# EAGLE design eggShield (EAGLE 6.1)
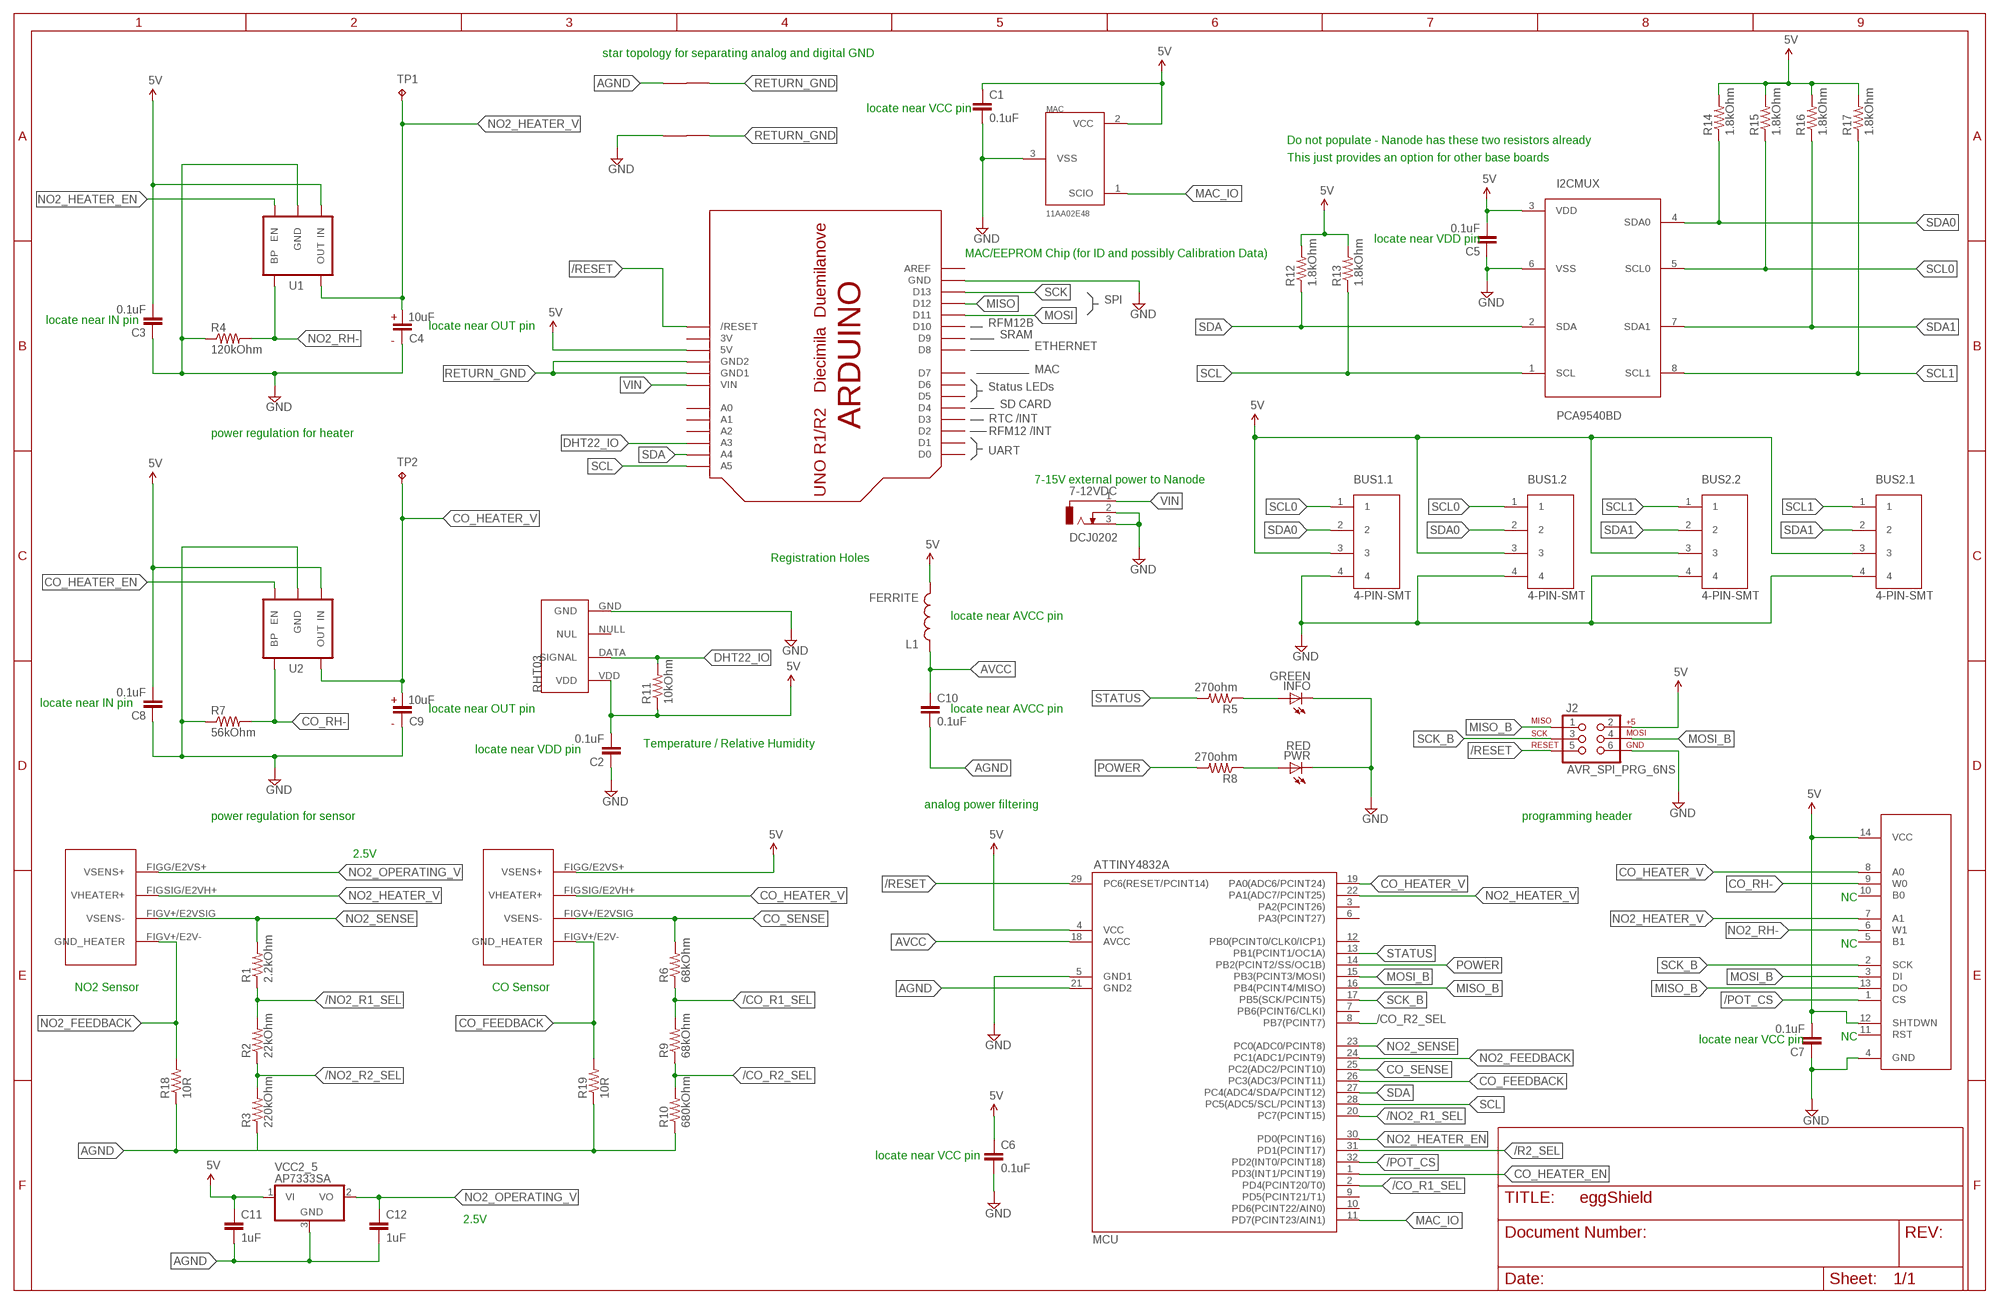
[diagram p0: schematic, sheet 1]

## Parts
7-12VDC  DCJ0202  [DCJ0202]
BUS1.1  4-PIN-SMT  [1775470-4]
BUS1.2  4-PIN-SMT  [1775470-4]
BUS2.1  4-PIN-SMT  [1775470-4]
BUS2.2  4-PIN-SMT  [1775470-4]
C1  0.1uF  CAP0805  [0805]
C2  0.1uF  CAP0805  [0805]
C3  0.1uF  CAP0805  [0805]
C4  10uF  EEE-1EA100WR  [TYPE-B_ALUMINUM_CAN]
C5  0.1uF  CAP0805  [0805]
C6  0.1uF  CAP0805  [0805]
C7  0.1uF  CAP0805  [0805]
C8  0.1uF  CAP0805  [0805]
C9  10uF  EEE-1EA100WR  [TYPE-B_ALUMINUM_CAN]
C10  0.1uF  CAP0805  [0805]
C11  1uF  CAP0805  [0805]
C12  1uF  CAP0805  [0805]
CO  E2V  [SR-4]
DHT22  RHT03  [1X04_LOCK]
I2CMUX  PCA9540BD  [SO8]
INFO  GREEN  LEDCHIPLED_0805  [CHIPLED_0805]
J2  AVR_SPI_PRG_6NS  [2X3-NS]
L1  FERRITE  INDUCTOR0805  [0805]
MAC  11AA02E48  [SOT23]
MCU  ATTINY4832A  [TQFP32-08]
N02  E2V  [SR-4]
PWR  RED  LEDCHIPLED_0805  [CHIPLED_0805]
R1  2.2kOhm  RESISTOR0805-RES  [0805]
R2  22kOhm  RESISTOR0805-RES  [0805]
R3  220kOhm  RESISTOR0805-RES  [0805]
R4  120kOhm  RESISTOR0805-RES  [0805]
R5  270ohm  RESISTOR0805-RES  [0805]
R6  68kOhm  RESISTOR0805-RES  [0805]
R7  56kOhm  RESISTOR0805-RES  [0805]
R8  270ohm  RESISTOR0805-RES  [0805]
R9  68kOhm  RESISTOR0805-RES  [0805]
R10  680kOhm  RESISTOR0805-RES  [0805]
R11  10kOhm  RESISTOR0805-RES  [0805]
R12  1.8kOhm  RESISTOR0805-RES  [0805]
R13  1.8kOhm  RESISTOR0805-RES  [0805]
R14  1.8kOhm  RESISTOR0805-RES  [0805]
R15  1.8kOhm  RESISTOR0805-RES  [0805]
R16  1.8kOhm  RESISTOR0805-RES  [0805]
R17  1.8kOhm  RESISTOR0805-RES  [0805]
R18  10R  RESISTOR0805-RES  [0805]
R19  10R  RESISTOR0805-RES  [0805]
TP1  TPPAD1-13  [P1-13]
TP2  TPPAD1-13  [P1-13]
U1  V_REG_LDOSMD  [SOT23-5]
U2  V_REG_LDOSMD  [SOT23-5]
U3  MCP42XXX  [SO014]
U$7  ARDUINO-NOHOLE  [ARDUINO-NOHOLE]
U$13  PLANE_COUPLER  [PLANE_COUPLER]
U$14  PLANE_COUPLER  [PLANE_COUPLER]
VCC2_5  AP7333SA  [SOT-23-3]

## Nets
5V: BUS1.1.3 BUS1.2.3 BUS2.1.3 BUS2.2.3 C1.1 C2.2 C3.2 C5.2 C6.1 C7.2 C8.2 C11.1 CO.FIGG/E2VS+(VSENS+) DHT22.VDD I2CMUX.3(VDD) J2.2 L1.2 MAC.2(VCC) MCU.4(VCC) R11.1 R12.2 R13.2 R14.2 R15.2 R16.2 R17.2 U1.1(IN) U2.1(IN) U3.12(SHTDWN) U3.14(VCC) U$7.5V VCC2_5.1(VI)
/CO_R1_SEL: MCU.2(PD4(PCINT20/T0)) R6.1 R9.2
/CO_R2_SEL: MCU.8(PB7(PCINT7)) R9.1 R10.2
/NO2_R1_SEL: MCU.20(PC7(PCINT15)) R1.1 R2.2
/NO2_R2_SEL: R2.1 R3.2
/POT_CS: MCU.32(PD2(INT0/PCINT18)) U3.1(CS)
/R2_SEL: MCU.31(PD1(PCINT17))
/RESET: J2.5 MCU.29(PC6(RESET/PCINT14)) U$7.RESET(/RESET)
AGND: C10.2 C11.2 C12.2 MCU.21(GND2) R3.1 R10.1 R18.1 R19.1 U$13.1 VCC2_5.3(GND)
AVCC: C10.1 L1.1 MCU.18(AVCC)
CO_FEEDBACK: CO.FIGV+/E2V-(GND_HEATER) MCU.26(PC3(ADC3/PCINT11)) R19.2
CO_HEATER_EN: MCU.1(PD3(INT1/PCINT19)) U2.3(EN)
CO_HEATER_V: C9.P$1 CO.FIGSIG/E2VH+(VHEATER+) MCU.19(PA0(ADC6/PCINT24)) TP2.TP U2.5(OUT) U3.8(A0)
CO_RH-: R7.2 U2.4(BP) U3.9(W0)
CO_SENSE: CO.FIGV+/E2VSIG(VSENS-) MCU.25(PC2(ADC2/PCINT10)) R6.2
DHT22_IO: DHT22.DATA(SIGNAL) R11.2 U$7.A3
GND: 7-12VDC.2 7-12VDC.3 BUS1.1.4 BUS1.2.4 BUS2.1.4 BUS2.2.4 C1.2 C2.1 C3.1 C4.P$2 C5.1 C6.2 C7.1 C8.1 C9.P$2 DHT22.GND I2CMUX.6(VSS) INFO.C J2.6 MAC.3(VSS) MCU.5(GND1) PWR.C R4.1 R7.1 U1.2(GND) U2.2(GND) U3.4(GND) U$7.GND U$14.1
MAC_IO: MAC.1(SCIO) MCU.11(PD7(PCINT23/AIN1))
MISO: U$7.D12
MISO_B: J2.1 MCU.16(PB4(PCINT4/MISO)) U3.13(DO)
MOSI: U$7.D11
MOSI_B: J2.4 MCU.15(PB3(PCINT3/MOSI)) U3.3(DI)
N$1: INFO.A R5.1
N$3: PWR.A R8.1
NO2_FEEDBACK: MCU.24(PC1(ADC1/PCINT9)) N02.FIGV+/E2V-(GND_HEATER) R18.2
NO2_HEATER_EN: MCU.30(PD0(PCINT16)) U1.3(EN)
NO2_HEATER_V: C4.P$1 MCU.22(PA1(ADC7/PCINT25)) N02.FIGSIG/E2VH+(VHEATER+) TP1.TP U1.5(OUT) U3.7(A1)
NO2_OPERATING_V: C12.1 N02.FIGG/E2VS+(VSENS+) VCC2_5.2(VO)
NO2_RH-: R4.2 U1.4(BP) U3.6(W1)
NO2_SENSE: MCU.23(PC0(ADC0/PCINT8)) N02.FIGV+/E2VSIG(VSENS-) R1.2
POWER: MCU.14(PB2(PCINT2/SS/OC1B)) R8.2
RETURN_GND: U$7.GND1 U$7.GND2 U$13.2 U$14.2
SCK: U$7.D13
SCK_B: J2.3 MCU.17(PB5(SCK/PCINT5)) U3.2(SCK)
SCL: I2CMUX.1(SCL) MCU.28(PC5(ADC5/SCL/PCINT13)) R13.1 U$7.A5
SCL0: BUS1.1.1 BUS1.2.1 I2CMUX.5(SCL0) R15.1
SCL1: BUS2.1.1 BUS2.2.1 I2CMUX.8(SCL1) R17.1
SDA: I2CMUX.2(SDA) MCU.27(PC4(ADC4/SDA/PCINT12)) R12.1 U$7.A4
SDA0: BUS1.1.2 BUS1.2.2 I2CMUX.4(SDA0) R14.1
SDA1: BUS2.1.2 BUS2.2.2 I2CMUX.7(SDA1) R16.1
STATUS: MCU.13(PB1(PCINT1/OC1A)) R5.2
VIN: 7-12VDC.1 U$7.VIN
Unconnected: DHT22.NULL(NUL) MCU.3(PA2(PCINT26)) MCU.6(PA3(PCINT27)) MCU.7(PB6(PCINT6/CLKI)) MCU.9(PD5(PCINT21/T1)) MCU.10(PD6(PCINT22/AIN0)) MCU.12(PB0(PCINT0/CLK0/ICP1)) U3.5(B1) U3.10(B0) U3.11(RST) U$7.A0 U$7.A1 U$7.A2 U$7.AREF U$7.D0 U$7.D1 U$7.D2 U$7.D3 U$7.D4 U$7.D5 U$7.D6 U$7.D7 U$7.D8 U$7.D9 U$7.D10

## Notes on the sheet
- star topology for separating analog and digital GND
- locate near VCC pin
- Do not populate - Nanode has these two resistors already
- This just provides an option for other base boards
- locate near VDD pin
- MAC/EEPROM Chip (for ID and possibly Calibration Data)
- SPI
- locate near IN pin | 10uF
- locate near OUT pin | RFM12B
- SRAM
- ETHERNET
- MAC
- Status LEDs
- SD CARD
- RTC /INT
- power regulation for heater | RFM12 /INT
- UART
- 7-15V external power to Nanode
- Registration Holes
- locate near AVCC pin
- locate near IN pin | 10uF
- locate near OUT pin | locate near AVCC pin
- Temperature / Relative Humidity
- locate near VDD pin
- analog power filtering
- power regulation for sensor | programming header
- 2.5V
- NC
- NC
- NO2 Sensor | CO Sensor
- locate near VCC pin | NC
- locate near VCC pin
- 2.5V

## Power pins joined to a net without a drawn wire
3V: U$7.3V

## Library data of the parts
7-12VDC = con-jack:DCJ0202: DC POWER JACK Source: DCJ0202.pdf
BUS1.1 BUS1.2 BUS2.1 BUS2.2 = wicked-device:4-PIN-SMT
C1-C3 C5-C8 C10-C12 = SparkFun-Passives:CAP: Capacitor Standard 0603 ceramic capacitor, and 0.1" leaded capacitor.
C4 C9 = wicked-device:EEE-1EA100WR
CO N02 = ricardo:E2V
DHT22 = ricardo:RHT03
I2CMUX = wicked-device:PCA9540B
INFO PWR = adafruit:LED: LED OSRAM: - CHIPLED LG R971, LG N971, LY N971, LG Q971, LY Q971, LO R971, LY R971 LH N974, LH R974 LS Q976, LO Q976, LY Q976 LO Q996 - Hyper CHIPLED LW Q18S LB Q993, LB Q99A, LB R99A - SideLED LS A670, LO A670, LY A670, LG A670, LP A670 LB A673, LV A673, LT A673, LW A673 LH A674 LY A675 LS A676, LA A676, LO A676, LY A676, LW A676 LS A679, LY A679, LG A679 - Hyper Micro SIDELED® LS Y876, LA Y876, LO Y876, LY Y876 LT Y87S - SmartLED LW L88C, LW L88S LB L89C, LB L89S, LG L890 LS L89K, LO L89K, LY L89K LS L896, LA L896, LO L896, LY L896 - TOPLED LS T670, LO T670, LY T670, LG T670, LP T670 LSG T670, LSP T670, LSY T670, LOP T670, LYG T670 LG T671, LOG T671, LSG T671 LB T673, LV T673, LT T673, LW T673 LH T674 LS T676, LA T676, LO T676, LY T676, LB T676, LH T676, LSB T676, LW T676 LB T67C, LV T67C, LT T67C, LS T67K, LO T67K, LY T67K, LW E67C LS E67B, LA E67B, LO E67B, LY E67B, LB E67C, LV E67C, LT E67C LW T67C LS T679, LY T679, LG T679 LS T770, LO T770, LY T770, LG T770, LP T770 LB T773, LV T773, LT T773, LW T773 LH T774 LS E675, LA E675, LY E675, LS T675 LS T776, LA T776, LO T776, LY T776, LB T776 LHGB T686 LT T68C, LB T68C - Hyper Mini TOPLED® LB M676 - Mini TOPLED Santana® LG M470 LS M47K, LO M47K, LY M47K Source: http://www.osram.convergy.de/
J2 = SparkFun:AVR_SPI_PRG_6: AVR ISP 6 Pin This is the reduced ISP connector for AVR programming. Common on Arduino. This footprint will take up less PCB space and can be used with a 10-pin to 6-pin adapter such as SKU: BOB-08508
L1 = SparkFun-Passives:INDUCTOR: Inductors Basic Inductor/Choke - 0603 and 1206. Footprints are not proven and vary greatly between part numbers.
MAC = nanode:11AA02E48
MCU = axeio-SparkFun:ATTINY48: ATtiny48/88 in 32 pin configuration.
R1-R19 = SparkFun:RESISTOR: Resistor Basic schematic elements and footprints for 0603, 1206, and PTH resistors.
TP1 TP2 = testpad:TP: Test pad
U1 U2 = SparkFun:V_REG_LDO: Voltage Regulator LDO Standard 150mA LDO voltage regulator in SOT-23 layout. Micrel part MIC5205. BP (by-pass) pin is used to lower output noise with 470pF cap.
U3 = SparkFun-AnalogIC:MCP42XXX: SPI controlled dual digital potentiometer by Microchip
U$7 = adafruit:ARDUINO: Arduino Diecimila/Duemilanove Make a shield with ease, this package has all the named pins as well as the two mounting drill holes and an outline of the USB and DC power connector. The outline is on the DIMENSION layer, so if your board house uses it they will cut the outline to match. http://www.ladyada.net/library/pcb/eaglelibrary.html
U$13 U$14 = wicked-device:PLANE_COUPLER
VCC2_5 = wicked-device:AP7333

## Board
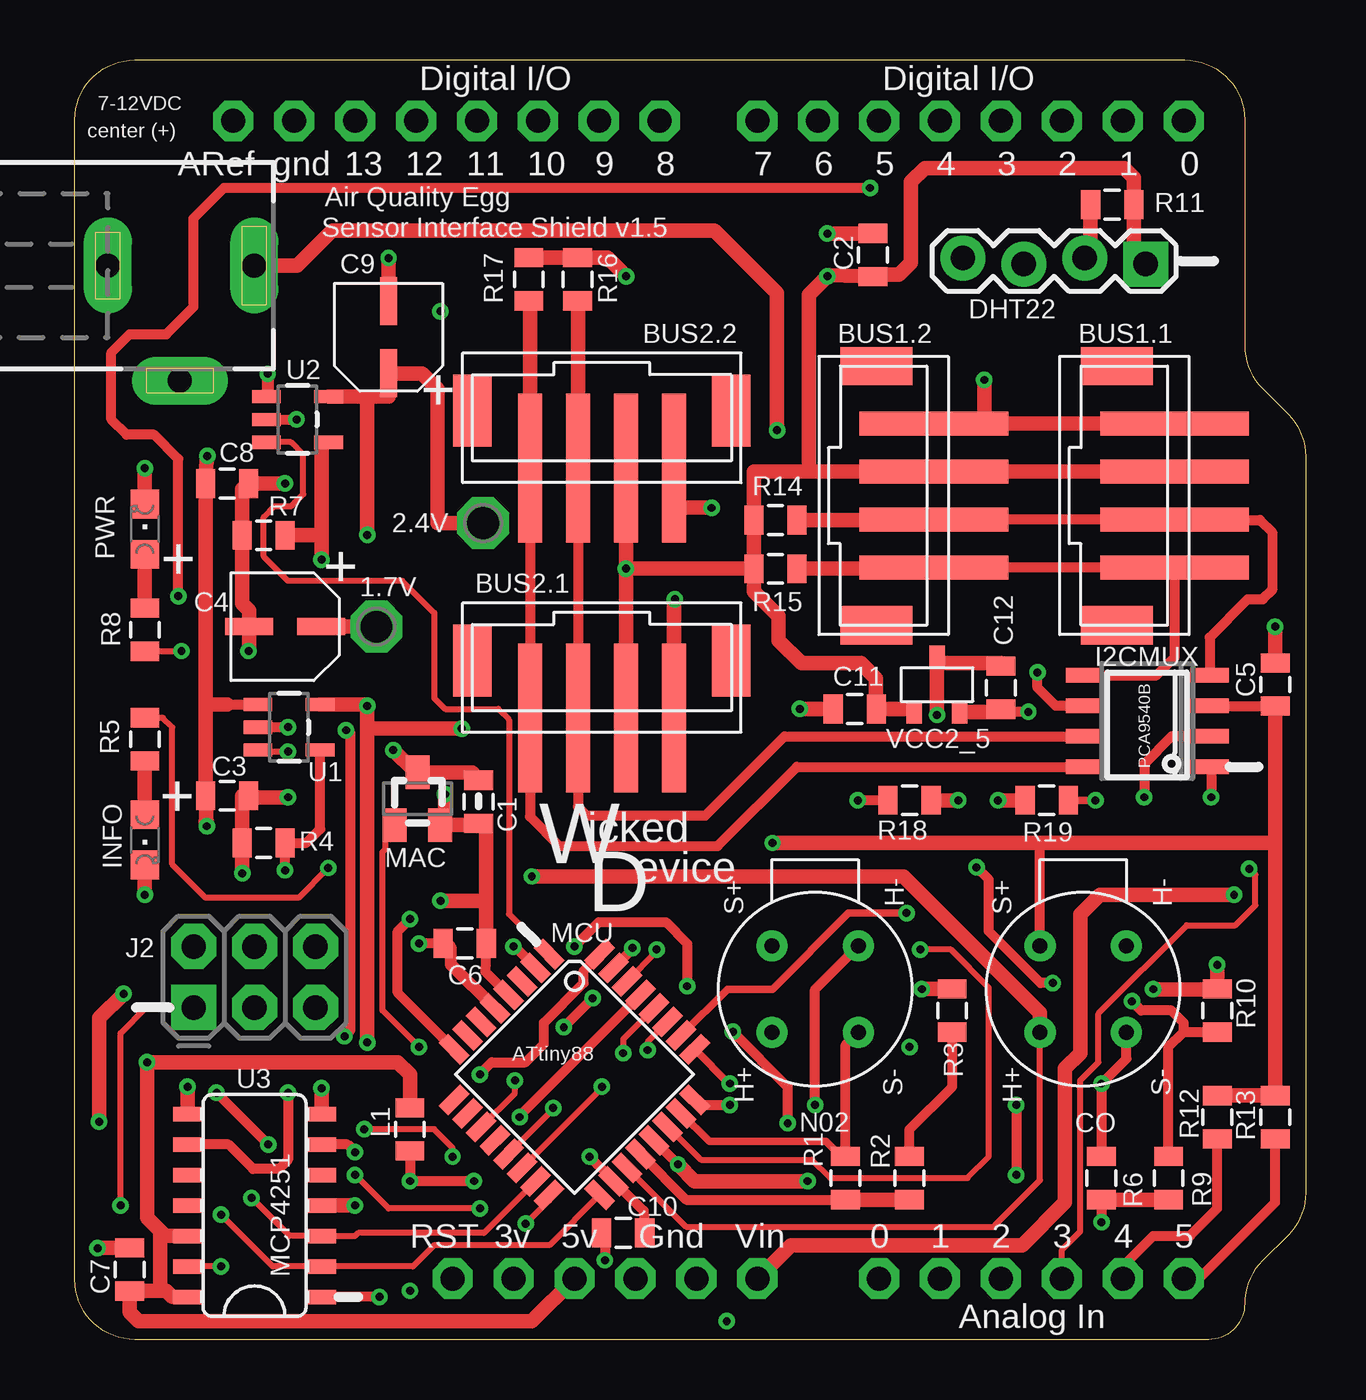
[diagram p1: board, top side]
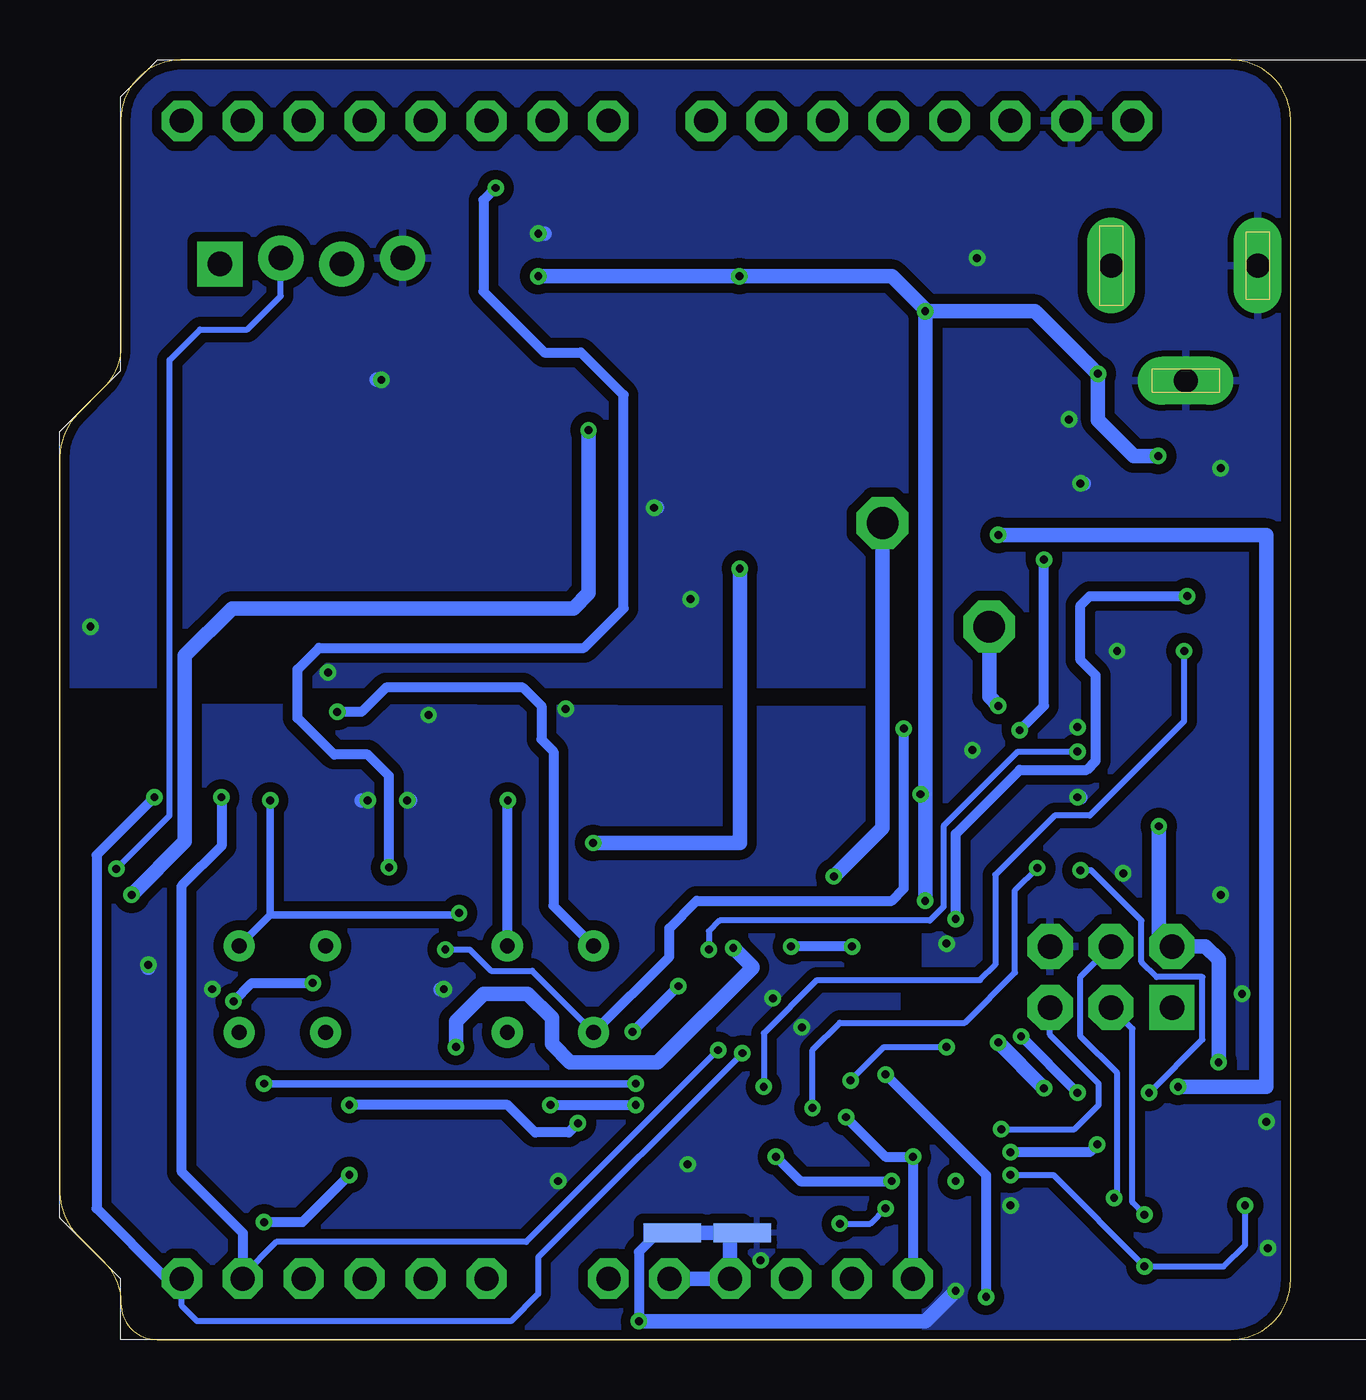
[diagram p2: board, bottom side, seen from below]

Size 51.31 x 53.34 mm. Coordinates in mm from the lower left corner, seen from the top.
Outline: 48.77,1.5 arc-90 47.26,0 2.5,0 arc-90 0,2.5 0,50.84 arc-90 2.5,53.34 46.27,53.34 arc-90 48.77,50.84 48.77,41.42 arc45 49.5,39.65 50.58,38.58 arc-45 51.31,36.81 51.31,6.12 arc-45 50.58,4.35 49.5,3.27 arc45 48.77,1.5
Copper layers (1*16): Top 0.0356mm / dielectric 1.5011mm / Bottom 0.0356mm
Design rules: minimum track width 6mil, minimum drill 13mil, track to track 6mil, track to pad 6mil, pad to pad 6mil, via to via 6mil, smd to smd 6mil, copper to edge 15mil, drill to drill 6mil, minimum pad ring 7mil, minimum via ring 7mil, stop-mask expansion 4mil, vias tented up to drill 20mil, thermal gap 10mil

### Footprints (pad centres in the part's own frame; a part is rotated, then mirrored left to right if it is on the bottom)
DCJ0202 = drill 1 pad 2 long: 1 0,3.1; 2 4.8,0; 3 0,-3
1775470-4 = smd 1 x 6.2: 1 3,0; 2 1,0; 3 -1,0; 4 -3,0 | smd 1.6 x 3: P$5 -5.4,-2.4; P$6 5.4,-2.4
0805 = smd 0.8 x 1.2: 1 -0.9,0; 2 0.9,0
TYPE-B_ALUMINUM_CAN = smd 0.7 x 2: P$1 0,-1.5; P$2 0,1.5
SR-4 = drill 0.62 pad 1.3: FIGG/E2VS+ 1.8,1.8; FIGSIG/E2VH+ -1.8,1.8; FIGV+/E2V- 1.8,-1.8; FIGV+/E2VSIG -1.8,-1.8
1X04_LOCK = drill 1.016 pad 1.88: DATA 2.54,-0.127; GND 7.62,-0.127; NULL 5.08,0.127 | drill 1.016 pad 1.88 square: VDD 0,0.127
SO8 = smd 0.6 x 1.6: 1 -1.905,-2.6; 2 -0.635,-2.6; 3 0.635,-2.6; 4 1.905,-2.6; 5 1.905,2.6; 6 0.635,2.6; 7 -0.635,2.6; 8 -1.905,2.6
CHIPLED_0805 = smd 1.2 x 1.2: A 0,-1.05; C 0,1.05
2X3-NS = drill 1.016 pad 1.88 square: 1 -2.54,-1.27 | drill 1.016 pad 1.88 octagon: 2 -2.54,1.27; 3 0,-1.27; 4 0,1.27; 5 2.54,-1.27; 6 2.54,1.27
SOT23 = smd 1 x 1.4: 1 -0.95,-1.1; 2 0.95,-1.1; 3 0,1.1
TQFP32-08 = smd 1.27 x 0.559: 1 -4.293,2.8; 2 -4.293,2; 3 -4.293,1.2; 4 -4.293,0.4; 5 -4.293,-0.4; 6 -4.293,-1.2; 7 -4.293,-2; 8 -4.293,-2.8; 17 4.293,-2.8; 18 4.293,-2; 19 4.293,-1.2; 20 4.293,-0.4; 21 4.293,0.4; 22 4.293,1.2; 23 4.293,2; 24 4.293,2.8 | smd 0.559 x 1.27: 9 -2.8,-4.293; 10 -2,-4.293; 11 -1.2,-4.293; 12 -0.4,-4.293; 13 0.4,-4.293; 14 1.2,-4.293; 15 2,-4.293; 16 2.8,-4.293; 25 2.8,4.293; 26 2,4.293; 27 1.2,4.293; 28 0.4,4.293; 29 -0.4,4.293; 30 -1.2,4.293; 31 -2,4.293; 32 -2.8,4.293
P1-13 = drill 1.321 pad 2.159 octagon: TP 0,0
SOT23-5 = smd 0.55 x 1.2: 1 -0.95,-1.3; 2 0,-1.3; 3 0.95,-1.3; 4 0.95,1.3; 5 -0.95,1.3
SO014 = smd 0.6 x 1.2: 1 -3.175,-2.8; 2 -1.905,-2.8; 3 -0.635,-2.8; 4 0.635,-2.8; 5 1.905,-2.8; 6 3.175,-2.8; 7 4.445,-2.8; 8 4.445,2.8; 9 3.175,2.8; 10 1.905,2.8; 11 0.635,2.8; 12 -0.635,2.8; 13 -1.905,2.8; 14 -3.175,2.8
ARDUINO-NOHOLE = drill 1 pad 1.676 octagon: 3V 35.56,2.54; 5V 38.1,2.54; A0 50.8,2.54; A1 53.34,2.54; A2 55.88,2.54; A3 58.42,2.54; A4 60.96,2.54; A5 63.5,2.54; AREF 23.876,50.8; D0 63.5,50.8; D1 60.96,50.8; D2 58.42,50.8; D3 55.88,50.8; D4 53.34,50.8; D5 50.8,50.8; D6 48.26,50.8; D7 45.72,50.8; D8 41.656,50.8; D9 39.116,50.8; D10 36.576,50.8; D11 34.036,50.8; D12 31.496,50.8; D13 28.956,50.8; GND 26.416,50.8; GND1 43.18,2.54; GND2 40.64,2.54; RESET 33.02,2.54; VIN 45.72,2.54
PLANE_COUPLER = smd 1.2 x 0.8: 1 -0.6,0; 2 0.6,0
SOT-23-3 = smd 0.65 x 0.95: 1 -0.95,-1.15; 2 0.95,-1.15; 3 0,1.15

### Placement (x,y rotation side)
7-12VDC  4.38,44.77 270 top
BUS1.1  45.85,35.18 270 top
BUS1.2  35.81,35.18 270 top
BUS2.1  21.97,25.91 180 top
BUS2.2  21.97,36.32 180 top
C1  16.83,22.42 90 top
C2  33.27,45.21 270 top
C3  6.35,22.67 180 top
C4  8.76,29.72 90 top
C5  50.04,27.3 270 top
C6  16.26,16.51 180 top
C7  2.29,2.92 270 top
C8  6.35,35.69 180 top
C9  13.08,41.78 0 top
C10  22.86,4.45 180 top
C11  32.51,26.29 180 top
C12  38.61,27.18 90 top
CO  42.04,14.61 90 top
DHT22  44.64,44.96 180 top
I2CMUX  44.7,25.78 90 top
INFO  2.92,20.83 180 top
J2  7.49,15.11 0 top
L1  13.97,8.76 90 top
MAC  14.29,22.54 0 top
MCU  20.83,11.05 315 top
N02  30.86,14.61 90 top
PWR  2.92,33.78 0 top
R1  32.13,6.73 90 top
R2  34.8,6.73 270 top
R3  36.58,13.72 270 top
R4  7.87,20.7 0 top
R5  2.92,25.02 90 top
R6  42.8,6.73 90 top
R7  7.87,33.53 0 top
R8  2.92,29.59 270 top
R9  45.59,6.73 270 top
R10  47.62,13.72 270 top
R11  43.24,47.31 180 top
R12  47.62,9.27 90 top
R13  50.04,9.27 90 top
R14  29.21,34.16 180 top
R15  29.21,32.13 180 top
R16  20.95,44.2 90 top
R17  18.92,44.2 90 top
R18  34.8,22.48 180 top
R19  40.51,22.48 0 top
TP1  12.57,29.72 0 top
TP2  17.02,34.04 0 top
U1  8.93,25.53 270 top
U2  9.29,38.35 270 top
U3  7.49,4.95 90 top
U$7  -17.27,0 0 top
U$13  22.86,4.45 180 bottom
U$14  25.78,4.45 0 bottom
VCC2_5  35.94,27.3 0 top

### Tracks (layer width: path | path; a pad name or v marks a point on that pad's centre or on a via)
5V  (via drill 0.33)
  Top 0.406: 5.53,26.48 5.46,26.54 | 5.53,24.58 5.46,24.51 | 6.35,26.48 U1.1 | 18.02,14.37 MCU.4 17.11,15.34 C6.1 | CO.FIGG/E2VS+ 40.24,20.68 40.26,20.7 | I2CMUX.3 50,26.42 C5.2
  Top 0.508: v8.04,40.26 8.04,39.36 U2.1
  Top 0.61: 5.53,26.48 6.35,26.48 | C2.2 33.31,44.32 | BUS1.1.3 BUS1.2.3 30.61,36.18 | BUS2.2.3 v22.97,32.13 | v22.97,32.13 BUS2.1.3 | 49.92,10.17 50.04,10.29 50.04,20.7 | 50.04,20.7 C5.2 | 30.61,36.18 30.61,43.56 v31.37,44.32 31.41,44.36 C2.2 | 22.97,44.31 v22.99,44.32 22.21,45.1 R16.2 R17.2 | R15.2 R14.2 | R14.2 28.31,36.18 30.61,36.18 | 50.04,20.7 40.26,20.7 v29.08,20.7 | C6.1 17.14,16.51 17.14,18.29 | 17.14,18.29 v15.24,18.29 | U$7.5V 19.05,0.76 2.67,0.76 2.29,1.14 C7.2 2.3,2.03 3.81,2.03 | R14.2 28.31,32.14 28.32,32.13 | 28.32,32.13 v22.97,32.13 | 5.46,21.59 v5.5,21.4 C3.2 5.46,22.67 5.46,24.51 5.46,26.54 5.46,35.69 C8.2 5.5,36.74 v5.52,36.83 | R13.2 49.92,10.17 | 49.92,10.17 R12.2 | VCC2_5.1 34.86,26.29 C11.1 33.4,26.33 33.4,27.56 32.77,28.19 30.29,28.19 29.34,29.15 29.34,30.16 28.32,31.18 28.32,32.13 | C2.2 33.3,44.39 34.35,44.39 34.86,44.9 34.86,48.26 35.43,48.83 43.75,48.83 44.14,48.44 R11.1 44.14,45.33 DHT22.VDD | 17.14,18.29 17.14,21.46 C1.1 16.83,21.44 MAC.2 15.43,21.64 v15.43,22.73 | L1.2 13.97,11.05 13.46,11.56 v3.01,11.56 3.01,5.08 3.77,4.32 | U3.12 3.77,4.32 | U3.14 4.06,1.78 3.81,2.03 | 3.81,2.03 arc-90 3.56,2.29 3.56,4.32 3.77,4.32
  Bottom 0.61: v31.37,44.32 v22.99,44.32 16.64,44.32 15.24,42.93 v15.24,42.86 | v15.24,42.86 v15.24,18.29 | v5.5,21.4 5.5,16.93 J2.2 3.56,16.38 3.01,15.84 v3.01,11.56 3.05,11.6 | v29.08,20.7 22.97,20.7 v22.97,32.13 | v5.52,36.83 6.54,36.83 8.04,38.33 v8.04,40.26 8.06,40.26 10.67,42.86 v15.24,42.86
/CO_R1_SEL  (via drill 0.33)
  Top 0.406: R6.1 v42.8,4.89 | MCU.2 18.32,16.38 v18.29,16.38 | v20.83,16.38 21.84,17.4 24.64,17.4 25.53,16.51 v25.53,14.73 | v27.43,12.83 29.72,10.54 v29.72,9.02 | v39.24,9.78 v39.24,6.86
  Top 0.61: R6.1 R9.2
  Bottom 0.406: v18.29,16.38 v20.83,16.38 | v25.53,14.73 v27.43,12.83 | v29.72,9.02 30.1,8.64 31.5,8.64 32.64,9.78 v39.24,9.78 | v39.24,6.86 41.21,4.89 v42.8,4.89
/CO_R2_SEL  (via drill 0.33)
  Top 0.406: R9.1 45.59,12.19 46.23,12.83 | 46.23,12.83 R10.2 | MCU.8 13.46,14.46 13.46,17.02 v13.97,17.53 | v4.32,30.99 4.32,36.7 3.3,37.72 2.16,37.72 1.52,38.35 1.52,41.15 2.29,41.91 3.81,41.91 4.95,43.05 4.95,46.74 6.22,48.01 v33.15,48.01 | 46.23,12.83 46.23,13.21 45.72,13.72 44.45,13.72 v44.07,14.1 | v40.77,14.86 40.26,14.86 38.1,17.02 38.1,19.18 v37.59,19.68
  Top 0.61: R10.2
  Bottom 0.406: v13.97,17.53 13.97,21.08 11.3,23.75 8.51,23.75 8.13,24.13 8.13,27.69 8.76,28.32 8.76,30.61 8.38,30.99 v4.32,30.99 | v44.07,14.1 43.31,14.86 v40.77,14.86 | v37.59,19.68 37.59,23.5 38.48,24.38 39.88,24.38 41.4,25.91 41.4,27.94 40.51,28.83 29.46,28.83 27.81,30.48 27.81,39.37 29.59,41.15 31.11,41.15 33.66,43.69 33.66,47.5 v33.15,48.01
/NO2_R1_SEL
  Top 0.406: 32.12,5.84 R1.1 25.48,5.83 MCU.20
  Top 0.61: R1.1 R2.2
/NO2_R2_SEL
  Top 0.406: R2.1 34.8,8.76 36.58,10.54 R3.2
/POT_CS  (via drill 0.33)
  Top 0.406: v16.89,11.05 16.89,11.07 17.38,11.56 18.8,11.56 19.56,12.32 19.56,13.21 21.21,14.86 21.21,15.37 21.88,16.04 MCU.32 | v12.7,1.78 U3.1
  Bottom 0.406: v16.89,11.05 12.7,6.86 v12.7,1.78
/R2_SEL  (via drill 0.33)
  Top 0.406: v23.24,16.32 23.18,16.23 MCU.31
  Bottom 0.61: v34.8,12.19 34.8,13.27 33.66,14.41 31.81,14.41 30.8,13.4 30.8,12.32 30.04,11.56 26.39,11.56 MCU.31 22.45,15.53 v23.24,16.32
/RESET  (via drill 0.33)
  Top 0.254: v15.75,7.62 15.75,8 14.99,8.76 v12.06,8.76
  Top 0.406: MCU.29 18.54,9.33 v18.54,9.27
  Bottom 0.254: J2.5 10.03,12.7 8,10.67 8,9.78 9.02,8.76 v12.06,8.76
  Bottom 0.406: v18.54,9.27 16.89,7.62 v15.75,7.62 U$7.RESET
AGND  (via drill 0.33)
  Top 0.406: C10.2 22.1,4.36 v22.1,3.3 | v47.62,15.62 47.62,14.61 | v20.38,13.02 v21.59,14.22 | MCU.21 v25.14,7.3 v25.15,7.3
  Top 0.61: R10.1 v47.62,15.62 | R19.1 v38.48,22.48 | R18.1 v36.83,22.48 | R3.1 v35.31,14.62 v35.31,14.61 | 47.62,14.61 v44.96,14.61 | C11.2 v30.23,26.29 | VCC2_5.3 35.94,28.19 | 35.94,28.19 v35.94,26.04 | C12.2 38.61,28.19 35.94,28.19 | v25.14,7.3 25.84,6.6 v30.54,6.6
  Bottom 0.61: v47.62,15.62 47.62,15.49 | v38.48,22.48 38.73,22.48 | v36.83,22.48 36.7,22.48 | v35.31,14.61 35.43,14.61
  pour Bottom (isolate 0.406): 16.38,26.29 51.44,26.42 51.44,2.54 51.27,2.54 arc90 48.77,0.04 arc-90 48.73,0 16.38,0
AVCC  (via drill 0.33)
  Top 0.406: L1.1 v13.97,6.6 v16.64,6.6 | v21.46,7.62 22.45,6.63 MCU.18 22.48,6.6 23.71,5.37 C10.1
  Bottom 0.406: v21.46,7.62 20.45,6.6 v16.64,6.6
CO_FEEDBACK  (via drill 0.33)
  Top 0.305: R19.2 v42.55,22.48 | MCU.26 27.21,14.61 29.08,14.61 32.26,17.78 v34.67,17.78
  Bottom 0.305: v42.55,22.48 42.55,17.7 | 42.55,17.7 CO.FIGV+/E2V- 43.94,16.3 | v34.67,17.78 34.75,17.7 42.55,17.7
CO_HEATER_EN
  Top 0.254: U2.3 9.02,37.4 9.53,36.89 9.53,35.24 9.02,34.73 8.32,34.73 7.87,34.29 7.87,32.64 8.89,31.62 13.65,31.62 14.99,30.29 14.99,26.73 15.43,26.29 17.65,26.29 18.1,25.84 18.1,17.74 MCU.1
CO_HEATER_V  (via drill 0.33)
  Top 0.254: MCU.19 25.48,4.7 38.29,4.7 40.24,6.65 CO.FIGSIG/E2VH+
  Top 0.61: CO.FIGSIG/E2VH+ 40.24,13.61 34.54,19.3 v19.05,19.3 | 12.19,39.3 v12.19,33.54 | U3.8 v4.7,10.54 | TP2.TP 15.11,34.04 15.11,39.62 14.48,40.26 13.11,40.26 C9.P$1 13.08,39.3 12.19,39.3 | U2.5 12.19,39.3
  Bottom 0.61: v12.19,33.54 1.15,33.54 1.02,33.4 | v4.7,10.54 1.02,10.54 1.02,33.4 | 1.02,33.4 1.02,33.53 | TP2.TP 17.02,21.34 v19.05,19.3
CO_RH-  (via drill 0.33)
  Top 0.406: U2.4 10.29,37.35 10.29,37.21 | v11.24,12.64 11.49,12.89 11.49,25.21 arc90 v11.3,25.4 | v8.89,10.29 8.89,7.49 8.51,7.11 7.43,7.11 6.41,8.13 U3.9
  Top 0.61: 10.29,37.21 10.29,33.53 | 10.29,33.53 v10.29,32.51 | 10.29,33.53 R7.2
  Bottom 0.406: v11.3,25.4 10.29,26.42 v10.29,32.51 | v8.89,10.29 v11.24,12.64
CO_SENSE  (via drill 0.33)
  Top 0.305: MCU.25 27.28,10.67 v27.3,10.67
  Top 0.406: R6.2 v42.8,10.67 43.84,11.71 CO.FIGV+/E2VSIG
  Bottom 0.305: v27.3,10.67 v42.8,10.67
DHT22_IO  (via drill 0.33)
  Top 0.254: U$7.A3 41.15,3.75 41.91,4.51 41.91,10.79 42.67,11.56 42.67,13.59 46.35,17.27 48.39,17.27 49.21,18.1 49.21,19.37 v48.96,19.62
  Top 0.61: R11.2 42.34,45.33 DHT22.DATA
  Bottom 0.254: v48.96,19.62 46.74,21.84 46.74,40.83 45.47,42.1 43.5,42.1 42.1,43.5 DHT22.DATA
GND  (via drill 0.33)
  Top 0.406: U1.2 v8.89,25.53 | U2.2 v9.25,38.35 | C6.2 v14.35,16.51 | I2CMUX.6 40.89,26.42 40.13,27.18 v40.13,27.81
  Top 0.508: MCU.5 15.68,15.63 15.68,16.23 arc90 C6.2
  Top 0.61: C5.1 v50.04,29.72 | v6.99,19.43 6.99,20.69 R4.1 6.97,22.67 C3.1 7.26,22.61 v8.89,22.61 | v8.76,35.69 C8.1 6.97,35.46 R7.1 6.99,33.52 6.99,30.67 7.26,30.39 C4.P$2 7.26,28.73 v7.24,28.7 | C2.1 33.23,46.1 v31.37,46.1 | BUS1.1.4 BUS1.2.4 37.91,38.18 v37.91,40.01 | 24.97,24.26 BUS2.1.4 24.97,30.81 v25.02,30.86 | BUS2.2.4 24.97,34.67 v26.54,34.67 | U3.4 v11.68,5.59 | C6.2 | INFO.C v2.92,18.54 | PWR.C v2.92,36.32 | v1.02,9.08 1.02,13.4 v2.03,14.41 | C9.P$2 v13.08,45.09 | v13.27,24.57 14.18,23.69 MAC.3 16.55,23.64 C1.2 | C7.1 0.96,3.82 v0.95,3.81
  Bottom 0.406: U$14.1 27.18,3.65 v27.18,0.76 | 10.16,16.51 J2.6
  Bottom 0.61: v8.89,22.61 8.76,22.61 | v8.76,35.69 8.64,35.69 | v31.37,46.1 31.11,46.1 | v26.54,34.67 26.42,34.67 | v13.97,2.03 15.24,0.76 v27.18,0.76 | v37.91,40.01 38.1,40.01
  pour Bottom (isolate 0.406): -1.27,53.34 15.24,53.34 15.24,-1.27 -1.27,-1.27
  pour Bottom (isolate 0.406): 52.07,27.3 15.24,27.3 15.24,53.34 52.07,53.34
MAC_IO  (via drill 0.33)
  Top 0.254: MCU.11 18.35,10.27 v18.35,10.79 | v14.35,12.19 12.83,13.72 12.83,20.32 12.95,20.45 12.95,20.95 13.34,21.34 MAC.1
  Bottom 0.254: v18.35,10.79 16.95,12.19 v14.35,12.19
MISO_B  (via drill 0.33)
  Top 0.254: MCU.16 19.77,5.8 v18.8,4.83 | v16.89,5.46 13.08,5.46 v11.68,6.86 | J2.1 2.98,13.84 1.91,12.76 v1.91,5.59 | v6.1,3.05 U3.13
  Bottom 0.254: v18.8,4.83 17.53,4.83 v16.89,5.46 | v11.68,6.86 9.91,6.86 v6.1,3.05 2.79,3.05 1.91,3.94 v1.91,5.59
MOSI_B  (via drill 0.33)
  Top 0.254: MCU.15 17.05,4.45 11.81,4.45 11.68,4.32 U3.3 8.95,4.32 v7.37,5.91
  Bottom 0.254: v7.37,5.91 7.24,6.03 7.24,11.11 8.76,12.64 8.76,15.11 J2.4
N$1
  Top 0.61: INFO.A R5.1
N$3
  Top 0.61: PWR.A R8.1
NO2_FEEDBACK  (via drill 0.33)
  Top 0.406: R18.2 v32.64,22.48 | v30.86,9.78 30.86,14.61 N02.FIGV+/E2V- | MCU.24 26.06,9.78 v27.3,9.78
  Bottom 0.406: v32.64,22.48 32.66,22.48 N02.FIGV+/E2V- | v30.86,9.78 v27.3,9.78
NO2_HEATER_EN  (via drill 0.33)
  Top 0.254: MCU.30 24.26,16.18 v24.26,16.26 | U1.3 7.7,24.51 v8.89,24.51
  Bottom 0.254: v24.26,16.26 24.26,17.02 23.81,17.46 15.05,17.46 14.48,18.03 14.48,21.4 11.37,24.51 v8.89,24.51
NO2_HEATER_V  (via drill 0.33)
  Top 0.254: MCU.22 24.73,8.86 26.1,7.49 30.73,7.49 31.5,6.73 37.21,6.73 38.1,7.62 38.1,14.67 36.51,16.26 v35.24,16.26
  Top 0.61: v12.19,12.38 12.19,25.46 | U1.5 12.13,26.48 v12.19,26.42 | TP1.TP C4.P$1 | v10.29,10.48 U3.7 | v16.13,25.46 12.19,25.46 | v12.19,26.42 12.19,25.46 | v12.19,26.42 12.06,26.42
  Bottom 0.254: v35.24,16.26 34.23,16.26 33.34,15.37 31.62,15.37 N02.FIGSIG/E2VH+
  Bottom 0.406: N02.FIGSIG/E2VH+ 25.91,15.96 25.91,17.14 24.77,18.29 16.64,18.29 16.13,18.8 v16.13,25.46
  Bottom 0.61: v12.19,12.38 v10.29,10.48 | TP1.TP 12.57,26.8 v12.19,26.42
NO2_OPERATING_V  (via drill 0.33)
  Top 0.406: VCC2_5.2 36.96,26.16 | v39.75,26.16 38.77,26.16 C12.1
  Top 0.61: VCC2_5.2 38.44,26.16 C12.1
  Bottom 0.406: N02.FIGG/E2VS+ 30.73,18.08 30.73,24.51 31.24,25.02 31.24,26.42 32,27.18 37.72,27.18 38.73,26.16 v39.75,26.16
NO2_RH-  (via drill 0.33)
  Top 0.406: 8.74,20.7 R4.2 | v8.76,19.56 R4.2 | R4.2 9.65,20.7 10.23,21.28 U1.4 | v5.91,10.29 v8.06,8.13 | v11.68,7.81 11.37,8.13 U3.6
  Top 0.61: 8.76,20.71 R4.2
  Bottom 0.254: v5.91,10.29 3.68,12.51 3.68,15.11 5.59,15.11 6.22,15.75 6.22,17.46 8.32,19.56 v8.76,19.56
  Bottom 0.406: v8.06,8.13 8.38,7.81 v11.68,7.81
NO2_SENSE
  Top 0.305: MCU.23 26.45,8.26 31.3,8.26 31.94,7.62 R1.2
  Top 0.406: N02.FIGV+/E2VSIG 32.13,12.28 R1.2
POWER  (via drill 0.33)
  Top 0.254: v4.45,28.7 4.43,28.69 R8.2 | MCU.14 21.97,10.49 v21.97,10.54
  Bottom 0.254: v4.45,28.7 4.45,25.78 8.38,21.84 9.84,21.84 12.32,19.37 12.32,15.62 12.95,14.99 19.75,14.99 21.97,12.76 v21.97,10.54
RETURN_GND
  Bottom 0.61: U$7.GND1 U$7.GND2 23.37,4.35 U$13.2 U$14.2
SCK_B  (via drill 0.33)
  Top 0.254: MCU.17 19.79,3.94 14.99,3.94 14.1,3.05 U3.2 8.26,3.05 v6.1,5.21
  Bottom 0.254: v6.1,5.21 6.6,5.71 6.6,12.95 J2.3
SCL  (via drill 0.33)
  Top 0.254: MCU.28 22.86,12.52 v22.86,11.94
  Top 0.406: U$7.A5 46.86,2.54 50.04,5.71 R13.1 | I2CMUX.1 47.37,23.81 v47.37,22.61
  Bottom 0.254: v22.86,11.94 31.37,3.43 31.37,1.91 32.51,0.76 45.59,0.76 46.23,1.4 U$7.A5
  Bottom 0.406: v47.37,22.61 49.78,20.19 49.78,5.46 46.86,2.54 U$7.A5
SCL0
  Top 0.406: I2CMUX.5 45.09,27.69 45.85,28.45 BUS1.1.1 BUS1.2.1 35.81,32.13
  Top 0.61: R15.1 35.77,32.13 BUS1.2.1
SCL1
  Top 0.406: BUS2.2.1 BUS2.1.1 18.97,21.8 20.19,20.57 26.8,20.57 30.1,23.88 I2CMUX.8
  Top 0.61: R17.1 18.97,43.3 BUS2.2.1
SDA  (via drill 0.33)
  Top 0.254: MCU.27 23.88,12.4 v23.88,12.06
  Top 0.406: U$7.A4 43.69,3.05 44.96,4.32 46.48,4.32 47.62,5.46 R12.1 | I2CMUX.2 45.72,25.15 44.58,24 v44.58,22.61
  Bottom 0.254: v23.88,12.06 31.88,4.06 42.29,4.06 43.69,2.67 U$7.A4
  Bottom 0.406: v44.58,22.61 44.58,20.57 46.23,18.92 46.23,6.99 43.69,4.45 U$7.A4
SDA0
  Top 0.406: I2CMUX.4 47.3,29.27 48.9,30.86 49.53,30.86 49.91,31.24 49.91,33.66 49.4,34.16 45.86,34.16 BUS1.1.2 BUS1.2.2 35.81,34.16
  Top 0.61: R14.1 35.8,34.16 BUS1.2.2
SDA1
  Top 0.406: BUS2.2.2 BUS2.1.2 20.97,22.21 21.34,21.84 26.29,21.84 29.59,25.15 I2CMUX.7
  Top 0.61: R16.1 20.97,43.3 BUS2.2.2
STATUS  (via drill 0.33)
  Top 0.254: 18.14,7.73 MCU.13 19.94,9.59 v19.94,9.65 | R5.2 3.67,25.92 4.06,25.53 4.06,19.81 5.46,18.41 9.32,18.41 v10.57,19.66
  Bottom 0.254: v10.57,19.66 11.49,18.73 11.49,15.3 13.59,13.21 18.8,13.21 19.94,12.06 v19.94,9.65
VIN  (via drill 0.33)
  Top 0.61: U$7.VIN 29.84,3.94 39.5,3.94 41.27,5.71 41.27,11.3 41.91,11.94 41.91,17.72 42.74,18.54 v48.32,18.54 | v29.27,37.91 29.27,43.62 26.67,46.23 10.73,46.23 9.27,44.77 7-12VDC.1
  Bottom 0.61: v29.27,37.91 29.27,31.11 29.91,30.48 44.13,30.48 46.1,28.51 46.1,20.77 v48.32,18.54

### Text on the board
tPlace: center (+) | Air Quality Egg | Sensor Interface Shield v1.5 | C9 | + | 2.4V | + | + | 1.7V | C4 | PCA9540B | + | icked | W | evice | D | ATtiny88 | MCP4251